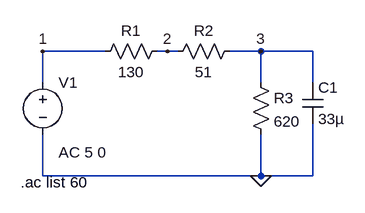
[diagram p0: schematic ECE2101L_Lab7_B2.asc]
ECE2101L_Lab7_B2.asc, the LTspice schematic file:
Version 4
SHEET 1 880 680
WIRE 96 80 0 80
WIRE 192 80 176 80
WIRE 208 80 192 80
WIRE 336 80 288 80
WIRE 416 80 336 80
WIRE 0 128 0 80
WIRE 336 128 336 80
WIRE 416 128 416 80
WIRE 0 272 0 208
WIRE 336 272 336 208
WIRE 336 272 0 272
WIRE 416 272 416 192
WIRE 416 272 336 272
FLAG 0 80 1
FLAG 192 80 2
FLAG 336 80 3
FLAG 336 272 0
SYMBOL voltage 0 112 R0
WINDOW 123 24 124 Left 2
WINDOW 39 0 0 Left 0
SYMATTR InstName V1
SYMATTR Value ""
SYMATTR Value2 AC 5 0
SYMBOL res 80 96 R270
WINDOW 0 32 56 VTop 2
WINDOW 3 0 56 VBottom 2
SYMATTR InstName R1
SYMATTR Value 130
SYMBOL res 192 96 R270
WINDOW 0 32 56 VTop 2
WINDOW 3 0 56 VBottom 2
SYMATTR InstName R2
SYMATTR Value 51
SYMBOL res 320 112 R0
SYMATTR InstName R3
SYMATTR Value 620
SYMBOL cap 400 128 R0
SYMATTR InstName C1
SYMATTR Value 33µ
TEXT -34 282 Left 2 !.ac list 60

The netlist it stands for:
* ECE2101L_Lab7_B2.asc
V1 1 0 AC 5 0
R1 1 2 130
R2 2 3 51
R3 3 0 620
C1 3 0 33µ
.ac list 60
.backanno
.end

* Results of the author's LTspice run, read from the files saved beside the schematic
* AC Analysis:
*   frequency = 60 
*   V(1) = 5 V
*   V(2) = 2.097 V
*   V(3) = 958.5 mV
*   I(C1) = 20.78 mA
*   I(R3) = 1.546 mA
*   I(R2) = 22.33 mA
*   I(R1) = 22.33 mA
*   I(V1) = -22.33 mA